# Altium project Kaplan.PrjPcb
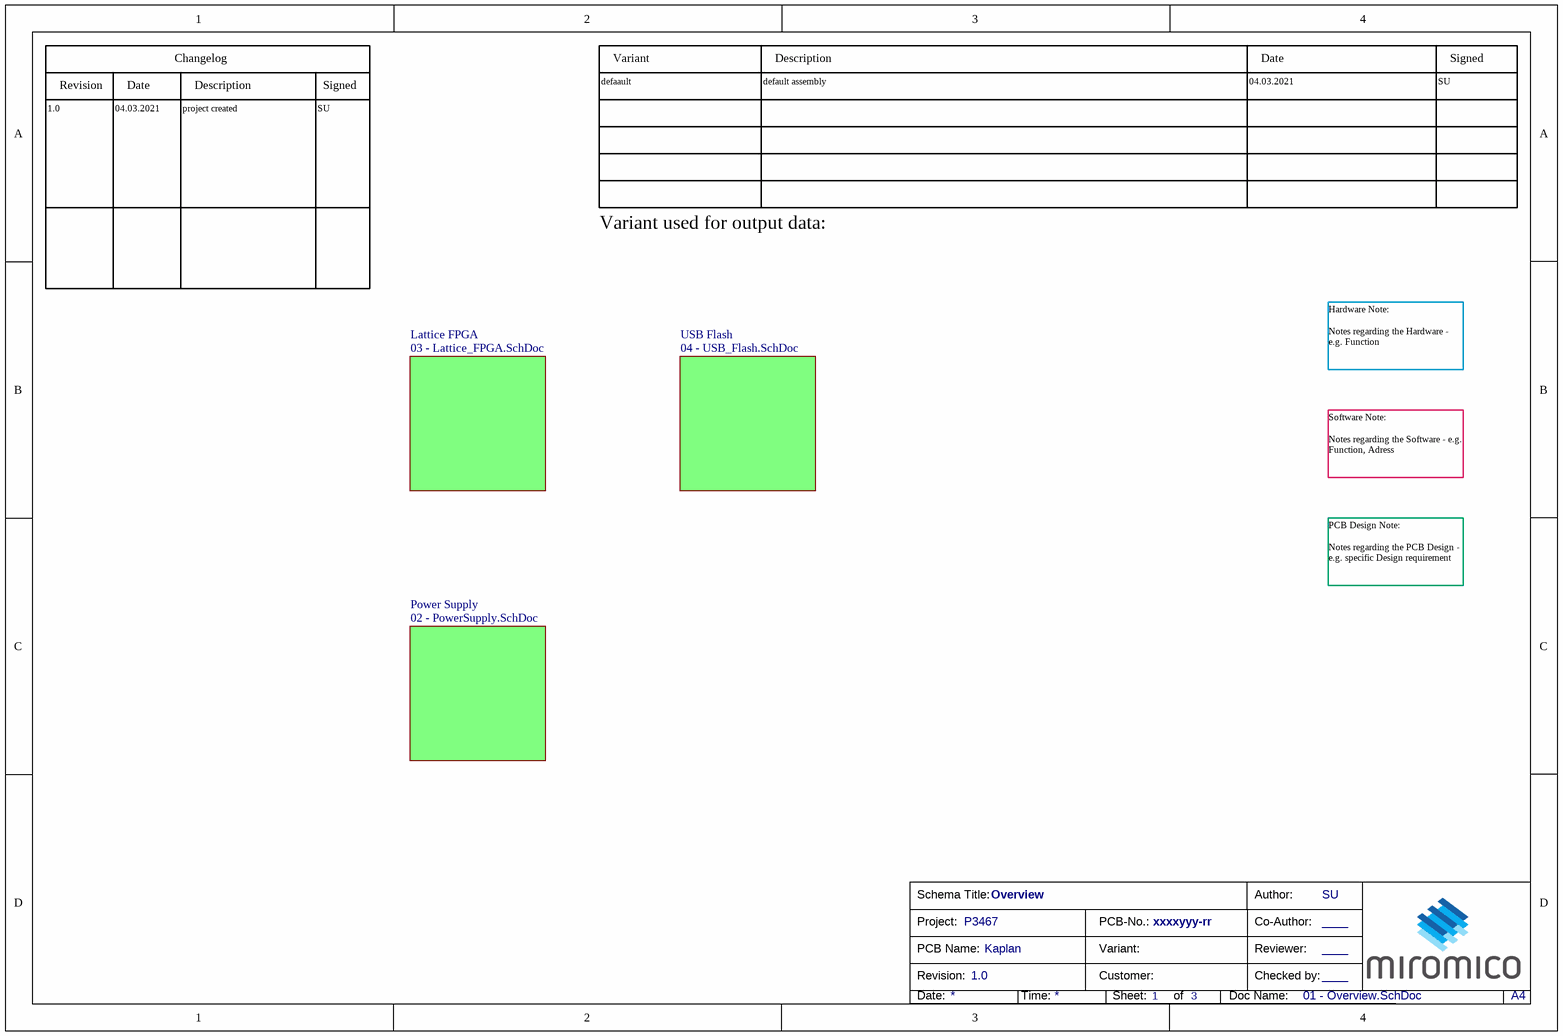
[diagram p0: 01 - Overview.SchDoc]
ApprovedDate: dd.mm.yyyy; AuthorMiromico: SU; BoardRevision: 1; CheckedByMiromico: ____; CheckedDate: dd.mm.yyyy; CoAuthorMiromico: ____; DrawDate: dd.mm.yyyy; MFGApprovedDate: dd.mm.yyyy; PCBName: Kaplan; PCBNumberMiromico: xxxxyyy-rr; ProjectNumberMiromico: P3467; ProjectRevision: 1.0; Reviewer: ____
4 sheets, 18 parts. Net scope: flat (ports and power ports of the same name join across sheets).
Board files: Kaplan.PcbDoc, Kaplan_Nutzen.PcbDoc
Sheets:
  01 - Overview.SchDoc
    Lattice FPGA = 03 - Lattice_FPGA.SchDoc
    USB Flash = 04 - USB_Flash.SchDoc
    Power Supply = 02 - PowerSupply.SchDoc

## Sheet 01 - Overview.SchDoc
size A4; DocumentNumber: 1; SheetNumber: 1; SheetTotal: 3; SchemaTitle: Overview

### Sub-sheets
Lattice FPGA = 03 - Lattice_FPGA.SchDoc: no entries
Power Supply = 02 - PowerSupply.SchDoc: no entries
USB Flash = 04 - USB_Flash.SchDoc: no entries

### Notes on the sheet
- Revision
- Date
- Changelog
- Description
- Signed
- defaault
- Variant
- default assembly
- 04.03.2021
- SU
- 1.0
- project created
- Variant used for output data:
- Hardware Note:
  Notes regarding the Hardware - e.g. Function
- Software Note:
  Notes regarding the Software - e.g. Function, Adress
- PCB Design Note:
  Notes regarding the PCB Design - e.g. specific Design requirement
- Schema Title:
- Project:
- PCB-No.:
- Author:
- Co-Author:
- Revision:
- PCB Name:
- Customer:
- Variant:
- Reviewer:
- Checked by:
- Date:
- Time:
- Sheet:
- of
- Doc Name:
- A4

## Sheet 03 - Lattice_FPGA.SchDoc
size A4; DocumentNumber: 1; SheetNumber: 1; SheetTotal: 3; SchemaTitle: Lattice FPGA
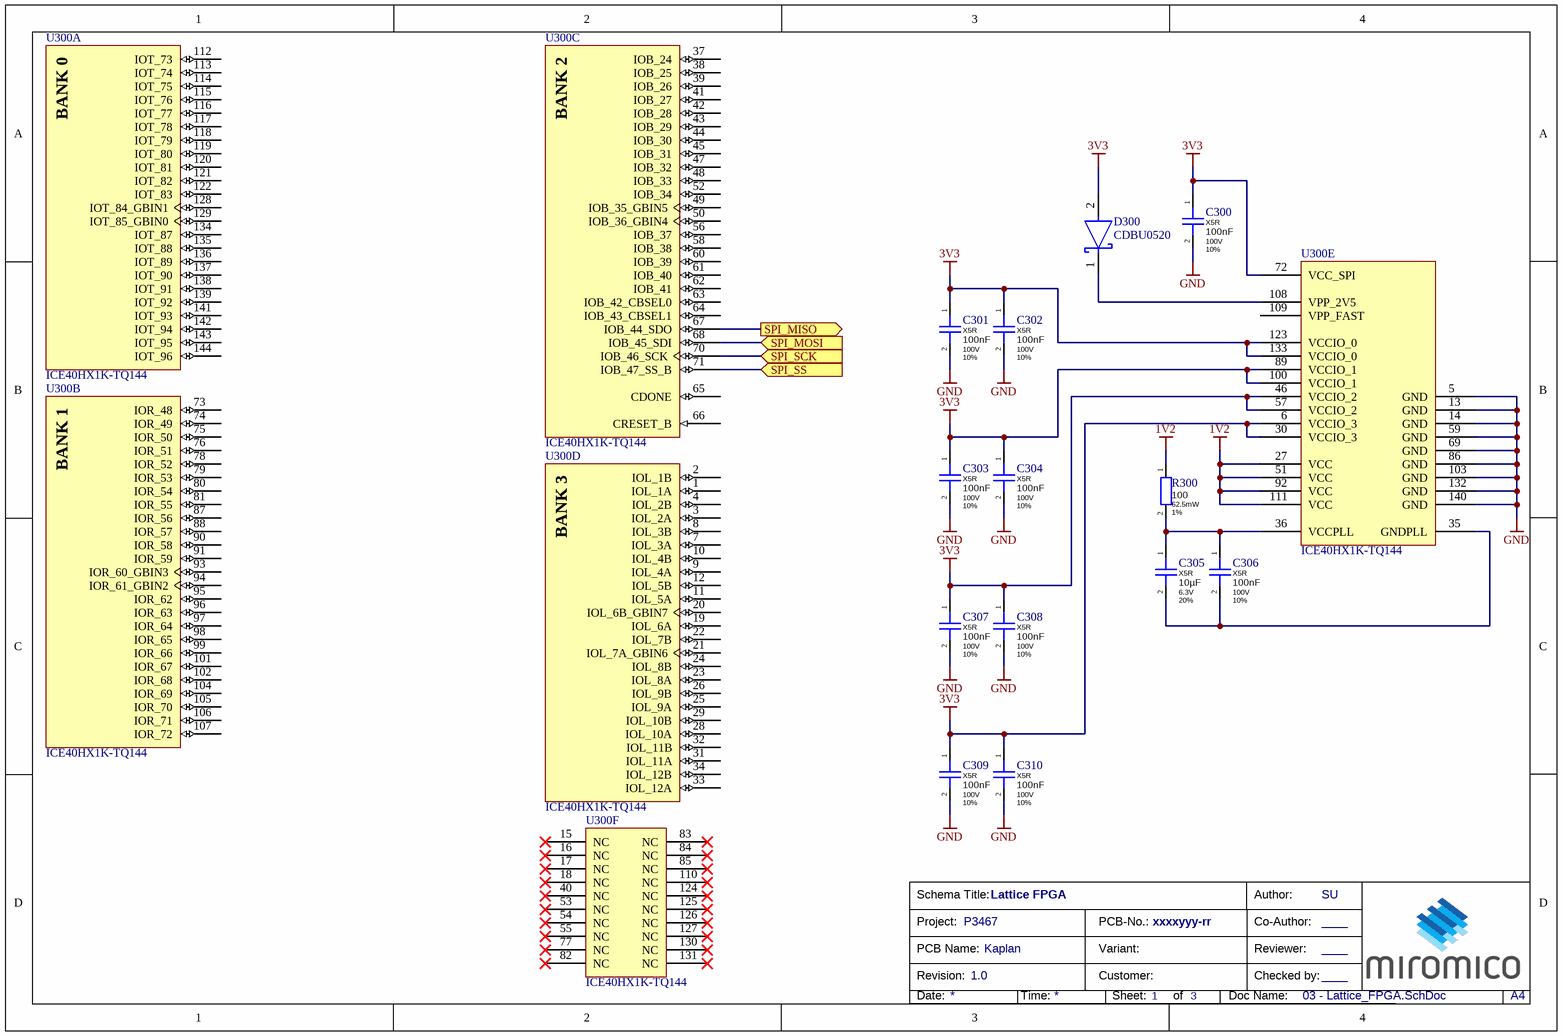
[diagram p1: 03 - Lattice_FPGA.SchDoc]

### Parts
C300  Dielectric: X5R  Capacitance: 100nF  Voltage Rating: 100V  Tolerance: 10%  [CAPC0402(1005)60_L]  (hidden comment: GRM155R62A104KE14D)
C301  Dielectric: X5R  Capacitance: 100nF  Voltage Rating: 100V  Tolerance: 10%  [CAPC0402(1005)60_L]  (hidden comment: GRM155R62A104KE14D)
C302  Dielectric: X5R  Capacitance: 100nF  Voltage Rating: 100V  Tolerance: 10%  [CAPC0402(1005)60_L]  (hidden comment: GRM155R62A104KE14D)
C303  Dielectric: X5R  Capacitance: 100nF  Voltage Rating: 100V  Tolerance: 10%  [CAPC0402(1005)60_L]  (hidden comment: GRM155R62A104KE14D)
C304  Dielectric: X5R  Capacitance: 100nF  Voltage Rating: 100V  Tolerance: 10%  [CAPC0402(1005)60_L]  (hidden comment: GRM155R62A104KE14D)
C305  Dielectric: X5R  Capacitance: 10µF  Voltage Rating: 6.3V  Tolerance: 20%  [CAPC0402(1005)60_L]  (hidden comment: GRJ155R60J106ME11D)
C306  Dielectric: X5R  Capacitance: 100nF  Voltage Rating: 100V  Tolerance: 10%  [CAPC0402(1005)60_L]  (hidden comment: GRM155R62A104KE14D)
C307  Dielectric: X5R  Capacitance: 100nF  Voltage Rating: 100V  Tolerance: 10%  [CAPC0402(1005)60_L]  (hidden comment: GRM155R62A104KE14D)
C308  Dielectric: X5R  Capacitance: 100nF  Voltage Rating: 100V  Tolerance: 10%  [CAPC0402(1005)60_L]  (hidden comment: GRM155R62A104KE14D)
C309  Dielectric: X5R  Capacitance: 100nF  Voltage Rating: 100V  Tolerance: 10%  [CAPC0402(1005)60_L]  (hidden comment: GRM155R62A104KE14D)
C310  Dielectric: X5R  Capacitance: 100nF  Voltage Rating: 100V  Tolerance: 10%  [CAPC0402(1005)60_L]  (hidden comment: GRM155R62A104KE14D)
D300  CDBU0520  [FP-0603-SOD-523F-MFG]
R300  Resistance: 100  Power Rating: 62.5mW  Tolerance: 1%  [RESC0402(1005)_L]  (hidden comment: RC0402FR-07100RL)
U300  ICE40HX1K-TQ144  [LATC-TQFP-144_L]  (parts A,B,C,D,E,F of 6)

### Ports
SPI_MISO (out), SPI_MOSI (in), SPI_SCK (in), SPI_SS (in)

### Nets
1V2: R300.1 U300.27(VCC) U300.51(VCC) U300.92(VCC) U300.111(VCC)
3V3: C300.1 C301.1 C302.1 C303.1 C304.1 C307.1 C308.1 C309.1 C310.1 D300.2(A) U300.6(VCCIO_3) U300.30(VCCIO_3) U300.46(VCCIO_2) U300.57(VCCIO_2) U300.72(VCC_SPI) U300.89(VCCIO_1) U300.100(VCCIO_1) U300.123(VCCIO_0) U300.133(VCCIO_0)
GND: C300.2 C301.2 C302.2 C303.2 C304.2 C307.2 C308.2 C309.2 C310.2 U300.5(GND) U300.13(GND) U300.14(GND) U300.59(GND) U300.69(GND) U300.86(GND) U300.103(GND) U300.132(GND) U300.140(GND)
NetC305_1: C305.1 C306.1 R300.2 U300.36(VCCPLL)
NetC305_2: C305.2 C306.2 U300.35(GNDPLL)
NetD300_1: D300.1(C) U300.108(VPP_2V5)
NetU300_67: U300.67(IOB_44_SDO) ; port SPI_MISO
NetU300_68: U300.68(IOB_45_SDI) ; port SPI_MOSI
NetU300_70: U300.70(IOB_46_SCK) ; port SPI_SCK
NetU300_71: U300.71(IOB_47_SS_B) ; port SPI_SS

Not connected (* = marked no-connect by the designer): U300 1(IOL_1A) 2(IOL_1B) 3(IOL_2A) 4(IOL_2B) 7(IOL_3A) 8(IOL_3B) 9(IOL_4A) 10(IOL_4B) 11(IOL_5A) 12(IOL_5B) 15(NC)* 16(NC)* 17(NC)* 18(NC)* 19(IOL_6A) 20(IOL_6B_GBIN7) 21(IOL_7A_GBIN6) 22(IOL_7B) 23(IOL_8A) 24(IOL_8B) 25(IOL_9A) 26(IOL_9B) 28(IOL_10A) 29(IOL_10B) 31(IOL_11A) 32(IOL_11B) 33(IOL_12A) 34(IOL_12B) 37(IOB_24) 38(IOB_25) 39(IOB_26) 40(NC)* 41(IOB_27) 42(IOB_28) 43(IOB_29) 44(IOB_30) 45(IOB_31) 47(IOB_32) 48(IOB_33) 49(IOB_35_GBIN5) 50(IOB_36_GBIN4) 52(IOB_34) 53(NC)* 54(NC)* 55(NC)* 56(IOB_37) 58(IOB_38) 60(IOB_39) 61(IOB_40) 62(IOB_41) 63(IOB_42_CBSEL0) 64(IOB_43_CBSEL1) 65(CDONE) 66(CRESET_B) 73(IOR_48) 74(IOR_49) 75(IOR_50) 76(IOR_51) 77(NC)* 78(IOR_52) 79(IOR_53) 80(IOR_54) 81(IOR_55) 82(NC)* 83(NC)* 84(NC)* 85(NC)* 87(IOR_56) 88(IOR_57) 90(IOR_58) 91(IOR_59) 93(IOR_60_GBIN3) 94(IOR_61_GBIN2) 95(IOR_62) 96(IOR_63) 97(IOR_64) 98(IOR_65) 99(IOR_66) 101(IOR_67) 102(IOR_68) 104(IOR_69) 105(IOR_70) 106(IOR_71) 107(IOR_72) 109(VPP_FAST) 110(NC)* 112(IOT_73) 113(IOT_74) 114(IOT_75) 115(IOT_76) 116(IOT_77) 117(IOT_78) 118(IOT_79) 119(IOT_80) 120(IOT_81) 121(IOT_82) 122(IOT_83) 124(NC)* 125(NC)* 126(NC)* 127(NC)* 128(IOT_84_GBIN1) 129(IOT_85_GBIN0) 130(NC)* 131(NC)* 134(IOT_87) 135(IOT_88) 136(IOT_89) 137(IOT_90) 138(IOT_91) 139(IOT_92) 141(IOT_93) 142(IOT_94) 143(IOT_95) 144(IOT_96)

### Notes on the sheet
- Schema Title:
- Project:
- PCB-No.:
- Author:
- Co-Author:
- Revision:
- PCB Name:
- Customer:
- Variant:
- Reviewer:
- Checked by:
- Date:
- Time:
- Sheet:
- of
- Doc Name:
- A4
- (in symbol CMP-0962-00009-1, part A) BANK 0
- (in symbol CMP-0962-00009-1, part B) BANK 1
- (in symbol CMP-0962-00009-1, part C) BANK 2
- (in symbol CMP-0962-00009-1, part D) BANK 3

### Library data of the parts
C300-C304 C306-C310 = CMP-00636-01: 0.1µF ±10% 100V Ceramic Capacitor X5R 0402 (1005 Metric); Manufacturer: Murata Electronics; RoHS Compliant: Yes; Mount: Surface Mount; Max Operating Temperature: 85°C; Min Operating Temperature: -55°C; Supplier Part Number 1: 490-10458-1-ND; Case/Package: 0402; Length: 0.039inch; Manufacturer Part Number: GRM155R62A104KE14D; Termination: SMD/SMT; Thickness: 0.022inch; ComponentLink1Description: Datasheet; Packaging: Tape and Reel; Height: 0.5mm; Package Quantity: 10000; Supplier 1: Digi-Key; Case Code (Imperial): 0402; Lead Free: Lead Free; Case Code (Metric): 1005; Voltage Rating (DC): 100V; Width: 0.5mm; Weight: 0.000212oz; REACH SVHC: No SVHC
C305 = CMP-00462-01: 10µF ±20% 6.3V Ceramic Capacitor X5R 0402 (1005 Metric); Manufacturer: Murata Electronics; Case Code (Metric): 1005; Supplier 1: Digi-Key; Length: 0.039inch; Case Code (Imperial): 0402; Mount: Surface Mount; Min Operating Temperature: -55°C; ComponentLink1Description: Datasheet; Max Operating Temperature: 85°C; Packaging: Cut Tape; Supplier Part Number 1: 490-13211-1-ND; Thickness: 0.028inch; Manufacturer Part Number: GRJ155R60J106ME11D; Features: Soft Termination; Case/Package: 0402; Width: 0.02inch
D300 = CMP-20227-000003-1: DIODE SCHOTTKY 20V 500MA 0603; Max Surge Current: 2A; Max Reverse Leakage Current: 100uA; Package Quantity: 1; Packaging: Tape and Reel; Mount: Surface Mount; Max Reverse Voltage (DC): 20V; Average Rectified Current: 500mA; Case/Package: SMD/SMT
R300 = CMP-00556-01: 100 Ohms ±1% 0.063W, 1/16W Chip Resistor 0402 (1005 Metric)  Thick Film; Manufacturer: Yageo; Voltage Rating (DC): 50V; Max Power Dissipation: 63mW; Temperature Coefficient: 100ppm/°C; Max Operating Temperature: 155°C; ComponentLink1Description: Datasheet; Military Standard: Not; Case Code (Metric): 1005; Technology: THICK FILM; Size Code: 0402; Resistance Tolerance: 1%; Case/Package: 0402; Construction: Rectangular; Features: Moisture Resistant; Series: RC; Supplier 1: Digi-Key; Number of Terminations: 2; Case Code (Imperial): 0402; Manufacturer Part Number: RC0402FR-07100RL; Supplier Part Number 1: 311-100LRCT-ND; Depth: 0.5mm; Packaging: Tape and Reel; Number of Pins: 2; Min Operating Temperature: -55°C; Width: 0.5mm; Termination: SMD/SMT; REACH SVHC: No SVHC; Resistor Type: Thick Film; Voltage Rating: 50V; Height: 0.32mm; Length: 1mm; Lead Free: Lead Free
U300 = CMP-0962-00009-1: iCE40 HX1K Series FPGA Family, 1280 Logic Cells, 1.2 V Core, 64 K Embedded RAM Bits, 144-pin TQFP, Pb-Free, Tray; Manufacturer: Lattice Semiconductor; Embedded RAM Bits: 64K; Logic Cells: 1280; Phase-Locked Loops: 1; Supply Voltage: 1.2V; Mounting Technology: Surface Mount; ComponentLink3URL: http://www.latticesemi.com/lit/docs/package/pkg.pdf; ComponentLink1URL: http://www.latticesemi.com/en; ComponentLink2Description: Datasheet; RoHS: TRUE; ComponentLink2URL: http://www.latticesemi.com/~/media/Documents/DataSheets/iCE/iCE40LPHXFamilyDataSheet.pdf; PackageVersion: Rev. 03.9, 02/2013; ComponentLink1Description: Manufacturer URL; PartNumber: ICE40HX1K-TQ144; DatasheetVersion: Rev. 02.9; PackageReference: TQFP-144; PackageDescription: 144-Pin Thin Quad Flat Package, Body 20 x 20 mm, Pitch 0.5 mm; Packing: Tray; ComponentLink3Description: Package Specification

## Sheet 04 - USB_Flash.SchDoc
size A4; DocumentNumber: 1; SheetNumber: 1; SheetTotal: 3; SchemaTitle: USB Flash
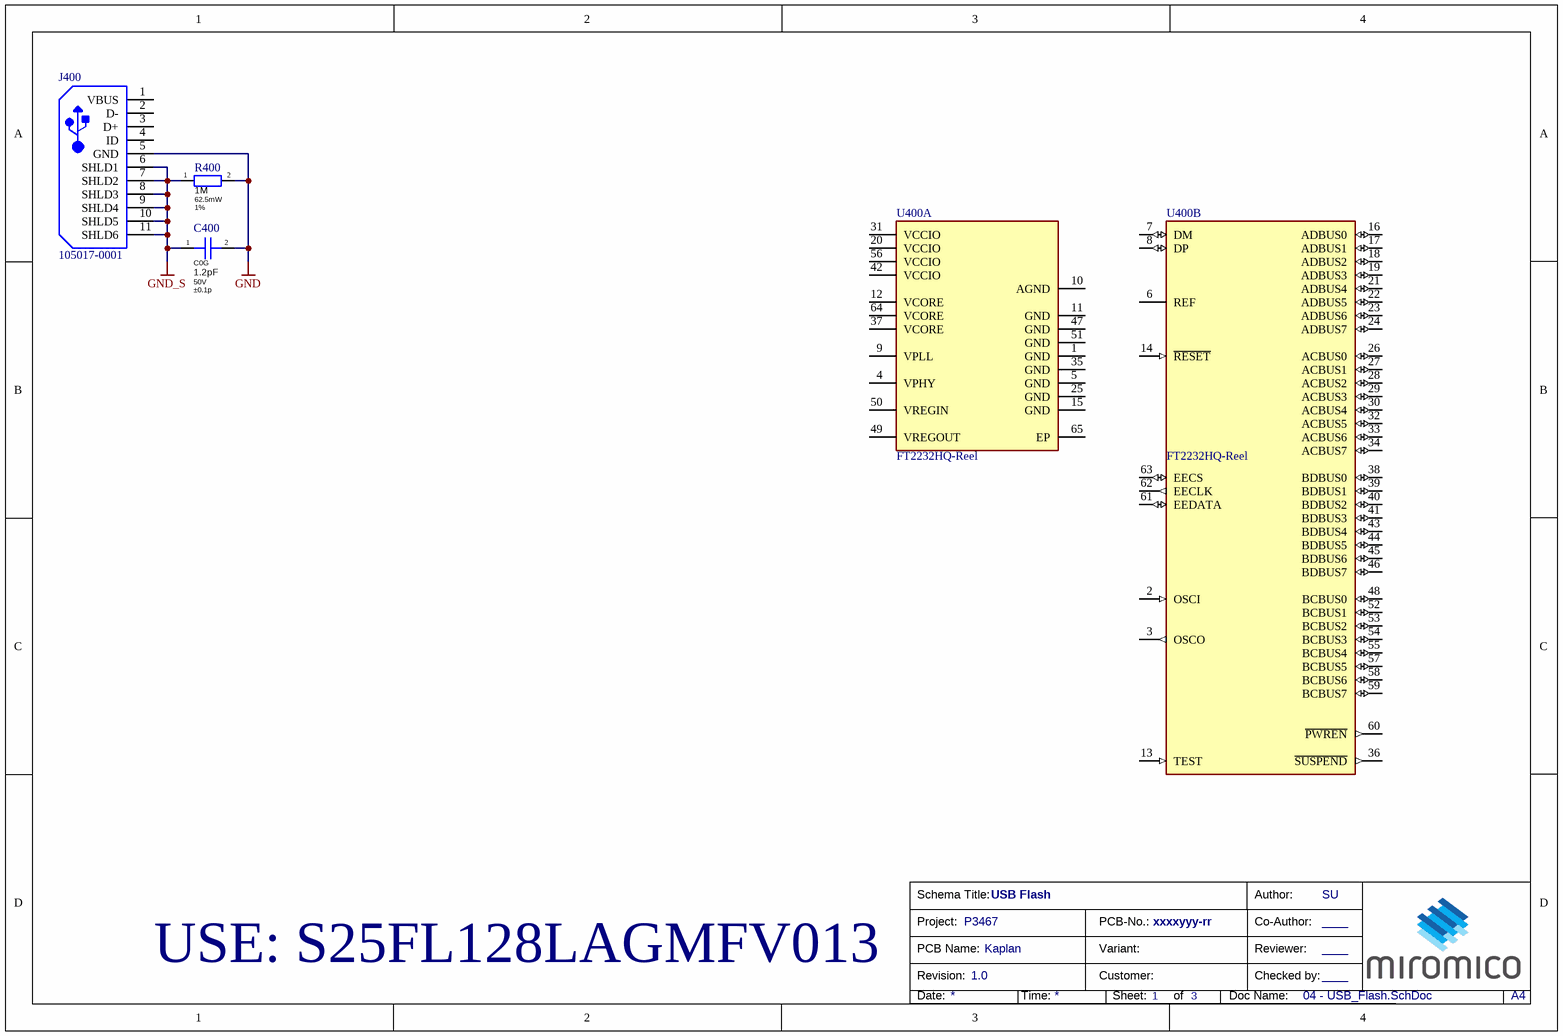
[diagram p2: 04 - USB_Flash.SchDoc]

### Parts
C400  Dielectric: C0G  Capacitance: 1.2pF  Voltage Rating: 50V  Tolerance: ±0.1p  [CAPC0402(1005)60_L]  (hidden comment: 500R07S1R2BV4T)
J400  105017-0001  [105017-0001-Footprint-1]
R400  Resistance: 1M  Power Rating: 62.5mW  Tolerance: 1%  [RESC0402(1005)_L]  (hidden comment: RMCF0402FT1M00)
U400  FT2232HQ-Reel  [FP-FT2232HQ-Reel-MFG]  (parts A,B of 2)

### Nets
GND: C400.2 J400.5(GND) R400.2
GND_S: C400.1 J400.6(SHLD1) J400.7(SHLD2) J400.8(SHLD3) J400.9(SHLD4) J400.10(SHLD5) J400.11(SHLD6) R400.1

Not connected (* = marked no-connect by the designer): J400 1(VBUS) 2(D-) 3(D+) 4(ID); U400 1(GND) 2(OSCI) 3(OSCO) 4(VPHY) 5(GND) 6(REF) 7(DM) 8(DP) 9(VPLL) 10(AGND) 11(GND) 12(VCORE) 13(TEST) 14(~{RESET}) 15(GND) 16(ADBUS0) 17(ADBUS1) 18(ADBUS2) 19(ADBUS3) 20(VCCIO) 21(ADBUS4) 22(ADBUS5) 23(ADBUS6) 24(ADBUS7) 25(GND) 26(ACBUS0) 27(ACBUS1) 28(ACBUS2) 29(ACBUS3) 30(ACBUS4) 31(VCCIO) 32(ACBUS5) 33(ACBUS6) 34(ACBUS7) 35(GND) 36(~{SUSPEND}) 37(VCORE) 38(BDBUS0) 39(BDBUS1) 40(BDBUS2) 41(BDBUS3) 42(VCCIO) 43(BDBUS4) 44(BDBUS5) 45(BDBUS6) 46(BDBUS7) 47(GND) 48(BCBUS0) 49(VREGOUT) 50(VREGIN) 51(GND) 52(BCBUS1) 53(BCBUS2) 54(BCBUS3) 55(BCBUS4) 56(VCCIO) 57(BCBUS5) 58(BCBUS6) 59(BCBUS7) 60(~{PWREN}) 61(EEDATA) 62(EECLK) 63(EECS) 64(VCORE) 65(EP)

### Notes on the sheet
- USE: S25FL128LAGMFV013
- Schema Title:
- Project:
- PCB-No.:
- Author:
- Co-Author:
- Revision:
- PCB Name:
- Customer:
- Variant:
- Reviewer:
- Checked by:
- Date:
- Time:
- Sheet:
- of
- Doc Name:
- A4

### Library data of the parts
C400 = CMP-00585-01: 1.2pF ±0.1pF 50V Ceramic Capacitor C0G, NP0 0402 (1005 Metric); Manufacturer: Johanson Technology Inc.; Case Code (Imperial): 0402; Radiation Hardening: No; Height: 0.64mm; Min Operating Temperature: -55°C; Supplier 1: Digi-Key; Packaging: Tape and Reel; Series: S; Package Quantity: 10000; Dielectric Material: Ceramic; Manufacturer Part Number: 500R07S1R2BV4T; Voltage Rating (DC): 50V; Case/Package: 0402; Contact Plating: Tin,Matte; Depth: 0.51mm; Width: 0.02inch; Termination: SMD/SMT; Supplier Part Number 1: 712-1268-1-ND; REACH SVHC: Unknown; Max Operating Temperature: 125°C; Case Code (Metric): 1005; ComponentLink1Description: Datasheet; Construction: Flat; Number of Pins: 2; Thickness: 0.024inch; Length: 1.02mm
J400 = CMP-00161-04: USB - micro B USB 2.0 Receptacle Connector 5 Position Surface Mount, Right Angle; Through Hole; Manufacturer: Molex, LLC; Manufacturer Part Number: 1050170001; Number of Circuits: 5; Voltage Rating: 30V; Current Rating: 1.8A; USB Standard: USB 2.0; Pitch: 0.65mm; Number of Ports: 1; Connector Type: Receptacle, USB; Depth: 7.5mm; Contact Plating: Gold; Contact Material: Copper, Copper Alloy; Features: Shielded; ComponentLink1Description: Datasheet; Orientation: Right Angle; Gender: Receptacle; Supplier 1: Digikey; Package Quantity: 1; Length: 8.2mm; Number of Contacts: 5; Packaging: Tape and Reel; Datasheet: https://www.molex.com/pdm_docs/sd/1050170001_sd.pdf; Halogen Free: Low Halogen; REACH SVHC: Unknown; Number of Terminals: 5; Radiation Hardening: No; Housing Material: Polymer; Max Voltage Rating (AC): 30V; Supplier Part Number 1: WM1399CT-ND; ComponentLink1URL: https://www.molex.com/pdm_docs/sd/1050170001_sd.pdf; Min Operating Temperature: -20°C; Number of Positions: 5; Voltage Rating (AC): 30V; Termination: Solder; Mount: Surface Mount; Max Operating Temperature: 85°C
R400 = CMP-00464-01: 1 MOhms ±1% 0,063W, 1/16W Chipwiderstand 0402 (1005 metrisch) AutomobilzulassungAEC-Q200 Dickschicht; Manufacturer: Stackpole Electronics Inc; Temperature Coefficient: 100ppm/°C; Max Power Dissipation: 63mW; ComponentLink1URL: https://www.seielect.com/catalog/sei-rmcf_rmcp.pdf; ComponentLink1Description: Datasheet; Max Operating Temperature: 155°C; Case/Package: 0402; Lead Free: Lead Free; Radiation Hardening: No; Min Operating Temperature: -55°C; Height: 0.016inch; Case Code (Imperial): 0402; Mount: Surface Mount; Number of Terminations: 2; Manufacturer Part Number: RMCF0402FT1M00; Features: Automotive AEC-Q200; Contact Plating: Tin,Matte; Supplier Part Number 1: RMCF0402FT1M00CT-ND; Width: 0.02inch; Length: 1mm; Packaging: Tape and Reel; Depth: 0.5mm; Military Standard: Not; Resistor Type: Thick Film; Supplier 1: Digi-Key; Case Code (Metric): 1005
U400 = CMP-0078-00004-5: IC USB HS DUAL UART/FIFO 64-QFN; Manufacturer: FTDI; Min Supply Voltage: 1.62V; Ciiva Ids: 1315829; Nominal Supply Current: 5-70mA; Standoff Height: 0mm; Import Ts: 1521843541; Number Of Ports: 1; Max Supply Voltage: 3.63V; Data Rate: 480Mbits/s; Interface: I2C,SPI,UART,USB,RS-232,RS-485,RS-422,Other; Usb Standard: USB 2.0; Octopart: https://octopart.com/ft2232hq-reel-ftdi-19172126; Ipc Land Pattern Name: QFN50P900X900X85-64; Ambient Temperature Range High: +85°C; RoHS: TRUE; Manufacturer Part Number: FT2232HQ-Reel; Automotive: No; Footprint Url: https://www.ftdichip.com/Support/Documents/TechnicalNotes/TN_166%20FTDI%20Example%20IC%20PCB%20Footprints.pdf; Temperature Range High: +85°C; ComponentLink2Description: Datasheet; Ambient Temperature Range Low: -40°C; Mouser Description: USB Interface IC USB HS to Dual UART/ FIFO/SPI/JTAG/I2C; ComponentLink2URL: https://www.ftdichip.com/Support/Documents/DataSheets/ICs/DS_FT2232H.pdf; Digikey Description: IC USB HS DUAL UART/FIFO 64-QFN; Release Date: 1383921489; Height: 0.9mm; Lead Free: Yes; Package: QFN64; Device Class L1: Integrated Circuits (ICs); Temperature: -40°C to +85°C; Temperature Range Low: -40°C; Category: IC; Device Class L2: Interface ICs; Device Class L3: USB Interface ICs

## Sheet 02 - PowerSupply.SchDoc
size A4; DocumentNumber: 1; SheetNumber: 1; SheetTotal: 3; SchemaTitle: Power Supply

### Notes on the sheet
- Schema Title:
- Project:
- PCB-No.:
- Author:
- Co-Author:
- Revision:
- PCB Name:
- Customer:
- Variant:
- Reviewer:
- Checked by:
- Date:
- Time:
- Sheet:
- of
- Doc Name:
- A4

## Nets that join several sheets
GND: 03 - Lattice_FPGA (18 pins), 04 - USB_Flash (C400.2 J400.5 R400.2)

## Assembly variants
default: all parts fitted